# EAGLE design AnalogSubProc (EAGLE 6.5.0)
AUTHOR: Ryan Julian (ryanjulian@berkeley.edu); DESIGN_NAME: ImageProc 2.5; REVISION: C; YEAR: 2012
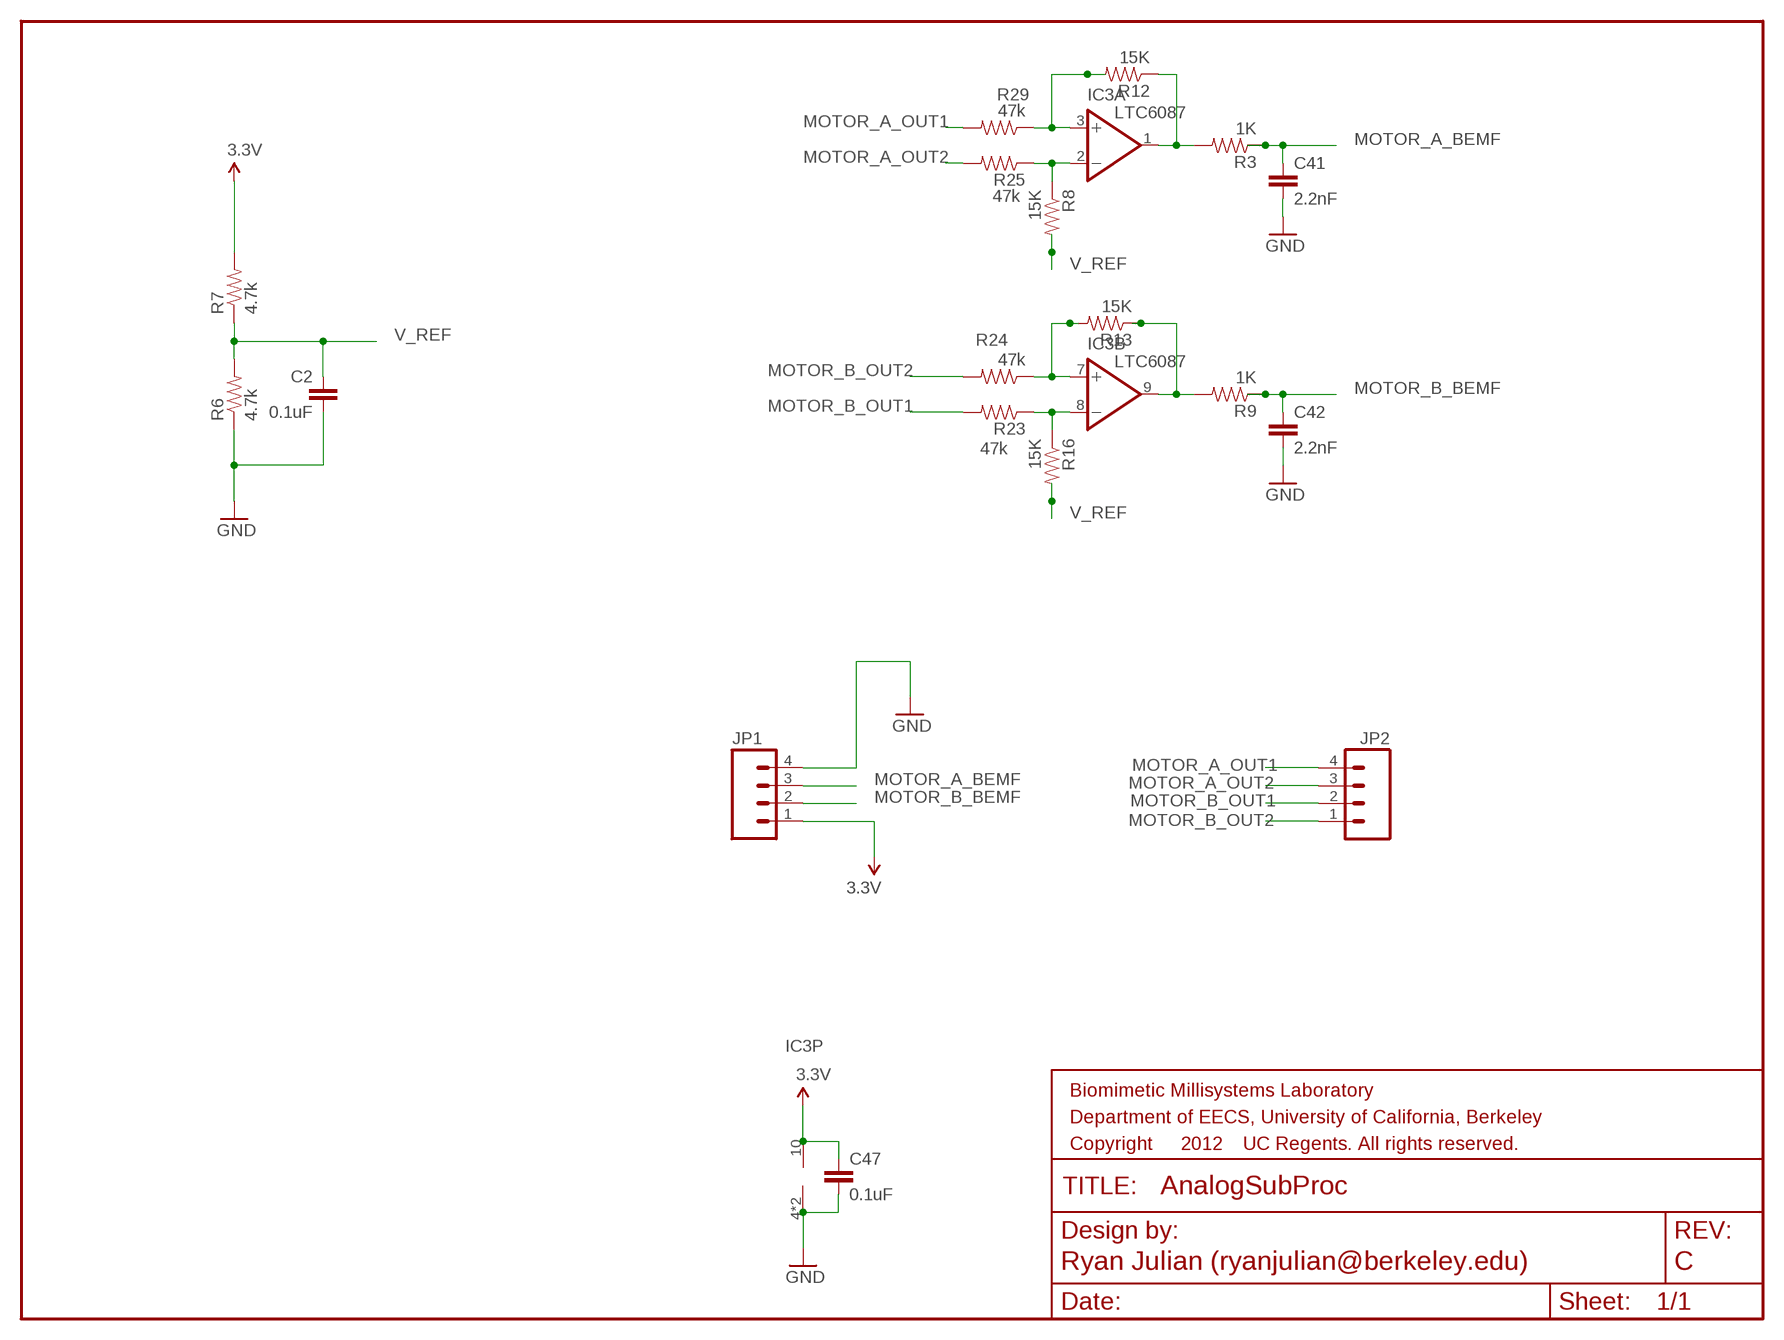
[diagram p0: schematic, sheet 1]
FRAME3 (FRAME-LETTER): SHEET_NAME: OpAmps

## Parts
C2  0.1uF  CAP0402-CAP  [0402-CAP]
C41  2.2nF  CAP0402-CAP  [0402-CAP]
C42  2.2nF  CAP0402-CAP  [0402-CAP]
C47  0.1uF  CAP0402-CAP  [0402-CAP]
IC3  LTC6087  [DFN-10]
JP1  M041.27MM  [1X04-1.27MM]
JP2  M041.27MM  [1X04-1.27MM]
R3  1K  RESISTOR0402-RES  [0402-RES]
R6  4.7k  RESISTOR0402-RES  [0402-RES]
R7  4.7k  RESISTOR0402-RES  [0402-RES]
R8  15K  RESISTOR0402-RES  [0402-RES]
R9  1K  RESISTOR0402-RES  [0402-RES]
R12  15K  RESISTOR0402-RES  [0402-RES]
R13  15K  RESISTOR0402-RES  [0402-RES]
R16  15K  RESISTOR0402-RES  [0402-RES]
R23  47k  RESISTOR0402-RES  [0402-RES]
R24  47k  RESISTOR0402-RES  [0402-RES]
R25  47k  RESISTOR0402-RES  [0402-RES]
R29  47k  RESISTOR0402-RES  [0402-RES]

## Nets
3.3V: C47.1 IC3.10(P:V+) JP1.1 R7.2
GND: C2.2 C41.2 C42.2 C47.2 IC3.4(P:V-) IC3.PAD(P:V-) JP1.4 R6.1
MOTOR_A_BEMF: C41.1 JP1.3 R3.1
MOTOR_A_OUT1: JP2.4 R29.2
MOTOR_A_OUT2: JP2.3 R25.2
MOTOR_B_BEMF: C42.1 JP1.2 R9.1
MOTOR_B_OUT1: JP2.2 R23.2
MOTOR_B_OUT2: JP2.1 R24.2
N$22: IC3.7(B:+IN) R13.2 R24.1
N$23: IC3.8(B:-IN) R16.1 R23.1
N$30: IC3.3(A:+IN) R12.2 R29.1
N$31: IC3.2(A:-IN) R8.1 R25.1
N$36: IC3.1(A:OUT) R3.2 R12.1
N$37: IC3.9(B:OUT) R9.2 R13.1
V_REF: C2.1 R6.2 R7.1 R8.2 R16.2
Unconnected: IC3.5 IC3.6

## Library data of the parts
C2 C41 C42 C47 = biomimetic:CAP: Capacitor Standard 0603 ceramic capacitor, and 0.1" leaded capacitor.
IC3 = biomimetic:LTC6087
JP1 JP2 = SparkFun-Connectors:M04: Header 4 Standard 4-pin 0.1" header. Use with straight break away headers (SKU : PRT-00116), right angle break away headers (PRT-00553), swiss pins (PRT-00743), machine pins (PRT-00117), and female headers (PRT-00115). Molex polarized connector foot print use with SKU : PRT-08231 with associated crimp pins and housings. 1MM SMD Version SKU: PRT-10208
R3 R6-R9 R12 R13 R16 R23-R25 R29 = biomimetic:RESISTOR: Resistor Basic schematic elements and footprints for 0603, 1206, and PTH resistors.

## Board
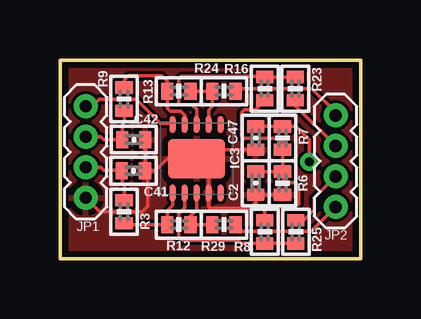
[diagram p1: board, top side]
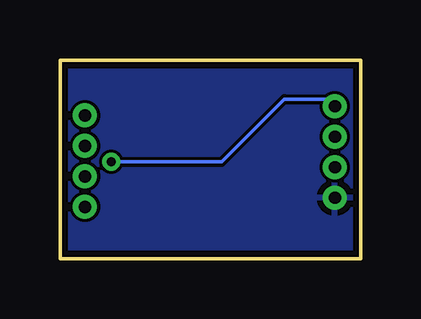
[diagram p2: board, bottom side, seen from below]

Size 12.52 x 8.28 mm. Coordinates in mm from the lower left corner, seen from the top.
Outline: 0,0 12.52,0 12.52,8.28 0,8.28 0,0
Copper layers (1*16): Top 2mil / dielectric 27mil / Bottom 2mil
Design rules "advancedcircuits-standard-biomimetic": minimum track width 5mil, minimum drill 10mil, track to track 5mil, track to pad 5mil, pad to pad 5mil, via to via 5mil, smd to smd 5mil, copper to edge 0.256540625mm, drill to drill 0.256540625mm, minimum pad ring 0.180340625mm, minimum via ring 0.180340625mm, stop-mask expansion 2mil, vias tented up to drill 0mil, thermal gap 10mil
tKeepout: 8 lines
bKeepout: 8 lines
tRestrict: 20 lines

### Footprints (pad centres in the part's own frame; a part is rotated, then mirrored left to right if it is on the bottom)
0402-CAP = smd 0.508 x 0.711: 1 -0.483,0; 2 0.483,0
DFN-10 = smd 0.25 x 0.7: 1 -1,-1.425; 2 -0.5,-1.425; 3 0,-1.425; 4 0.5,-1.425; 5 1,-1.425; 6 1,1.425; 7 0.5,1.425; 8 0,1.425; 9 -0.5,1.425; 10 -1,1.425 | smd 2.38 x 1.65: PAD 0,0
1X04-1.27MM = drill 0.508 pad 1: 1 0,0; 2 1.27,0; 3 2.54,0; 4 3.81,0
0402-RES = smd 0.508 x 0.711: 1 -0.483,0; 2 0.483,0

### Placement (x,y rotation side)
C2  8.15,3.15 270 top
C41  3.06,3.67 0 top
C42  3.07,4.97 0 top
C47  8.15,5.03 270 top
IC3  5.69,4.17 0 top
JP1  1.07,6.35 270 top
JP2  11.48,5.97 270 top
R3  2.67,1.96 270 top
R6  9.27,3.15 90 top
R7  9.27,5.03 90 top
R8  8.53,1.12 90 top
R9  2.67,6.65 90 top
R12  4.95,1.42 0 top
R13  4.95,6.99 0 top
R16  8.53,7.09 270 top
R23  9.8,7.09 270 top
R24  6.83,6.99 0 top
R25  9.83,1.12 90 top
R29  6.83,1.42 0 top

### Tracks (layer width: path | path; a pad name or v marks a point on that pad's centre or on a via)
3.3V  (via drill 0.38)
  Top 0.152: IC3.10 4.69,5.65 4.18,5.65 3.17,6.66 1.63,6.66 1.32,6.35 JP1.1 | 7.98,5.51 C47.1 R7.2 9.83,5.51 10.39,4.95 v10.39,4.04
  Bottom 0.152: v10.39,4.04 5.79,4.04 3.17,6.66 1.37,6.66 JP1.1
GND
  Top 0.152: IC3.PAD 6.19,3.67 IC3.4 6.19,2.17 6.25,2.11 7.92,2.11 8.15,2.34 C2.2 R6.1 | C41.2 3.97,3.67 4.5,4.19 5.66,4.19 IC3.PAD | C41.2 3.66,3.56 3.66,2.18 3.43,1.96 1.65,1.96 JP1.4 | C41.2 3.54,4.95 C42.2 | C47.2 6.07,4.55 IC3.PAD
  pour Bottom: 0,8.28 12.52,8.28 12.52,0 0,0
  pour Top: 0,8.28 12.52,8.28 12.52,0 0,0
MOTOR_A_BEMF
  Top 0.152: R3.1 2.67,3.1 2.59,3.17 2.59,3.66 C41.1 2.57,3.68 1.83,3.68 1.7,3.81 JP1.3
MOTOR_A_OUT1
  Top 0.152: R29.2 7.59,1.14 10.46,1.14 JP2.4
MOTOR_A_OUT2
  Top 0.152: R25.2 10.16,1.6 10.59,2.03 10.59,2.54 JP2.3
MOTOR_B_BEMF
  Top 0.152: C42.1 | R9.1 2.67,5.66 2.59,5.59 C42.1 | C42.1 1.82,4.97 1.7,5.08 JP1.2
MOTOR_B_OUT1
  Top 0.152: R23.2 9.8,6.38 JP2.2
MOTOR_B_OUT2
  Top 0.152: R24.2 7.42,7.09 10.49,7.09 11.48,6.1 JP2.1
N$22
  Top 0.152: R13.2 R24.1 6.35,6.35 6.19,6.19 IC3.7
N$23
  Top 0.152: R16.1 8.51,7.57 8.36,7.42 | IC3.8 5.69,6.22 5.49,6.43 5,6.43 4.95,6.48 4.95,7.49 5.05,7.6 8.51,7.6 R16.1 | R16.1 R23.1
N$30
  Top 0.152: R29.1 R12.2 5.44,1.78 5.69,2.03 IC3.3
N$31
  Top 0.152: IC3.2 5.19,2.12 4.95,1.88 4.95,0.91 5.11,0.76 7.42,0.76 7.54,0.64 R8.1 R25.1
N$36
  Top 0.152: R3.2 2.72,1.42 R12.1 4.47,2.01 4.69,2.23 IC3.1
N$37
  Top 0.152: R13.1 4.47,6.76 | IC3.9 5.19,5.99 5.03,6.15 4.6,6.15 4.47,6.27 R13.1 | R13.1 4.47,7.39 4.24,7.62 2.84,7.62 2.67,7.44 R9.2
V_REF
  Top 0.152: R6.2 R7.1 9.27,4.88 9.12,5.03 7.62,5.03 7.57,5.08 7.57,6.1 7.67,6.2 8.13,6.2 R16.2 | R6.2 9.32,3.68 9.32,3.3 9.45,3.17 9.83,3.17 9.96,3.05 9.96,2.29 9.83,2.16 8.69,2.16 8.53,2.01 R8.2 | R6.2 C2.1